# Altium schematic sheet car.SchDoc
size A2
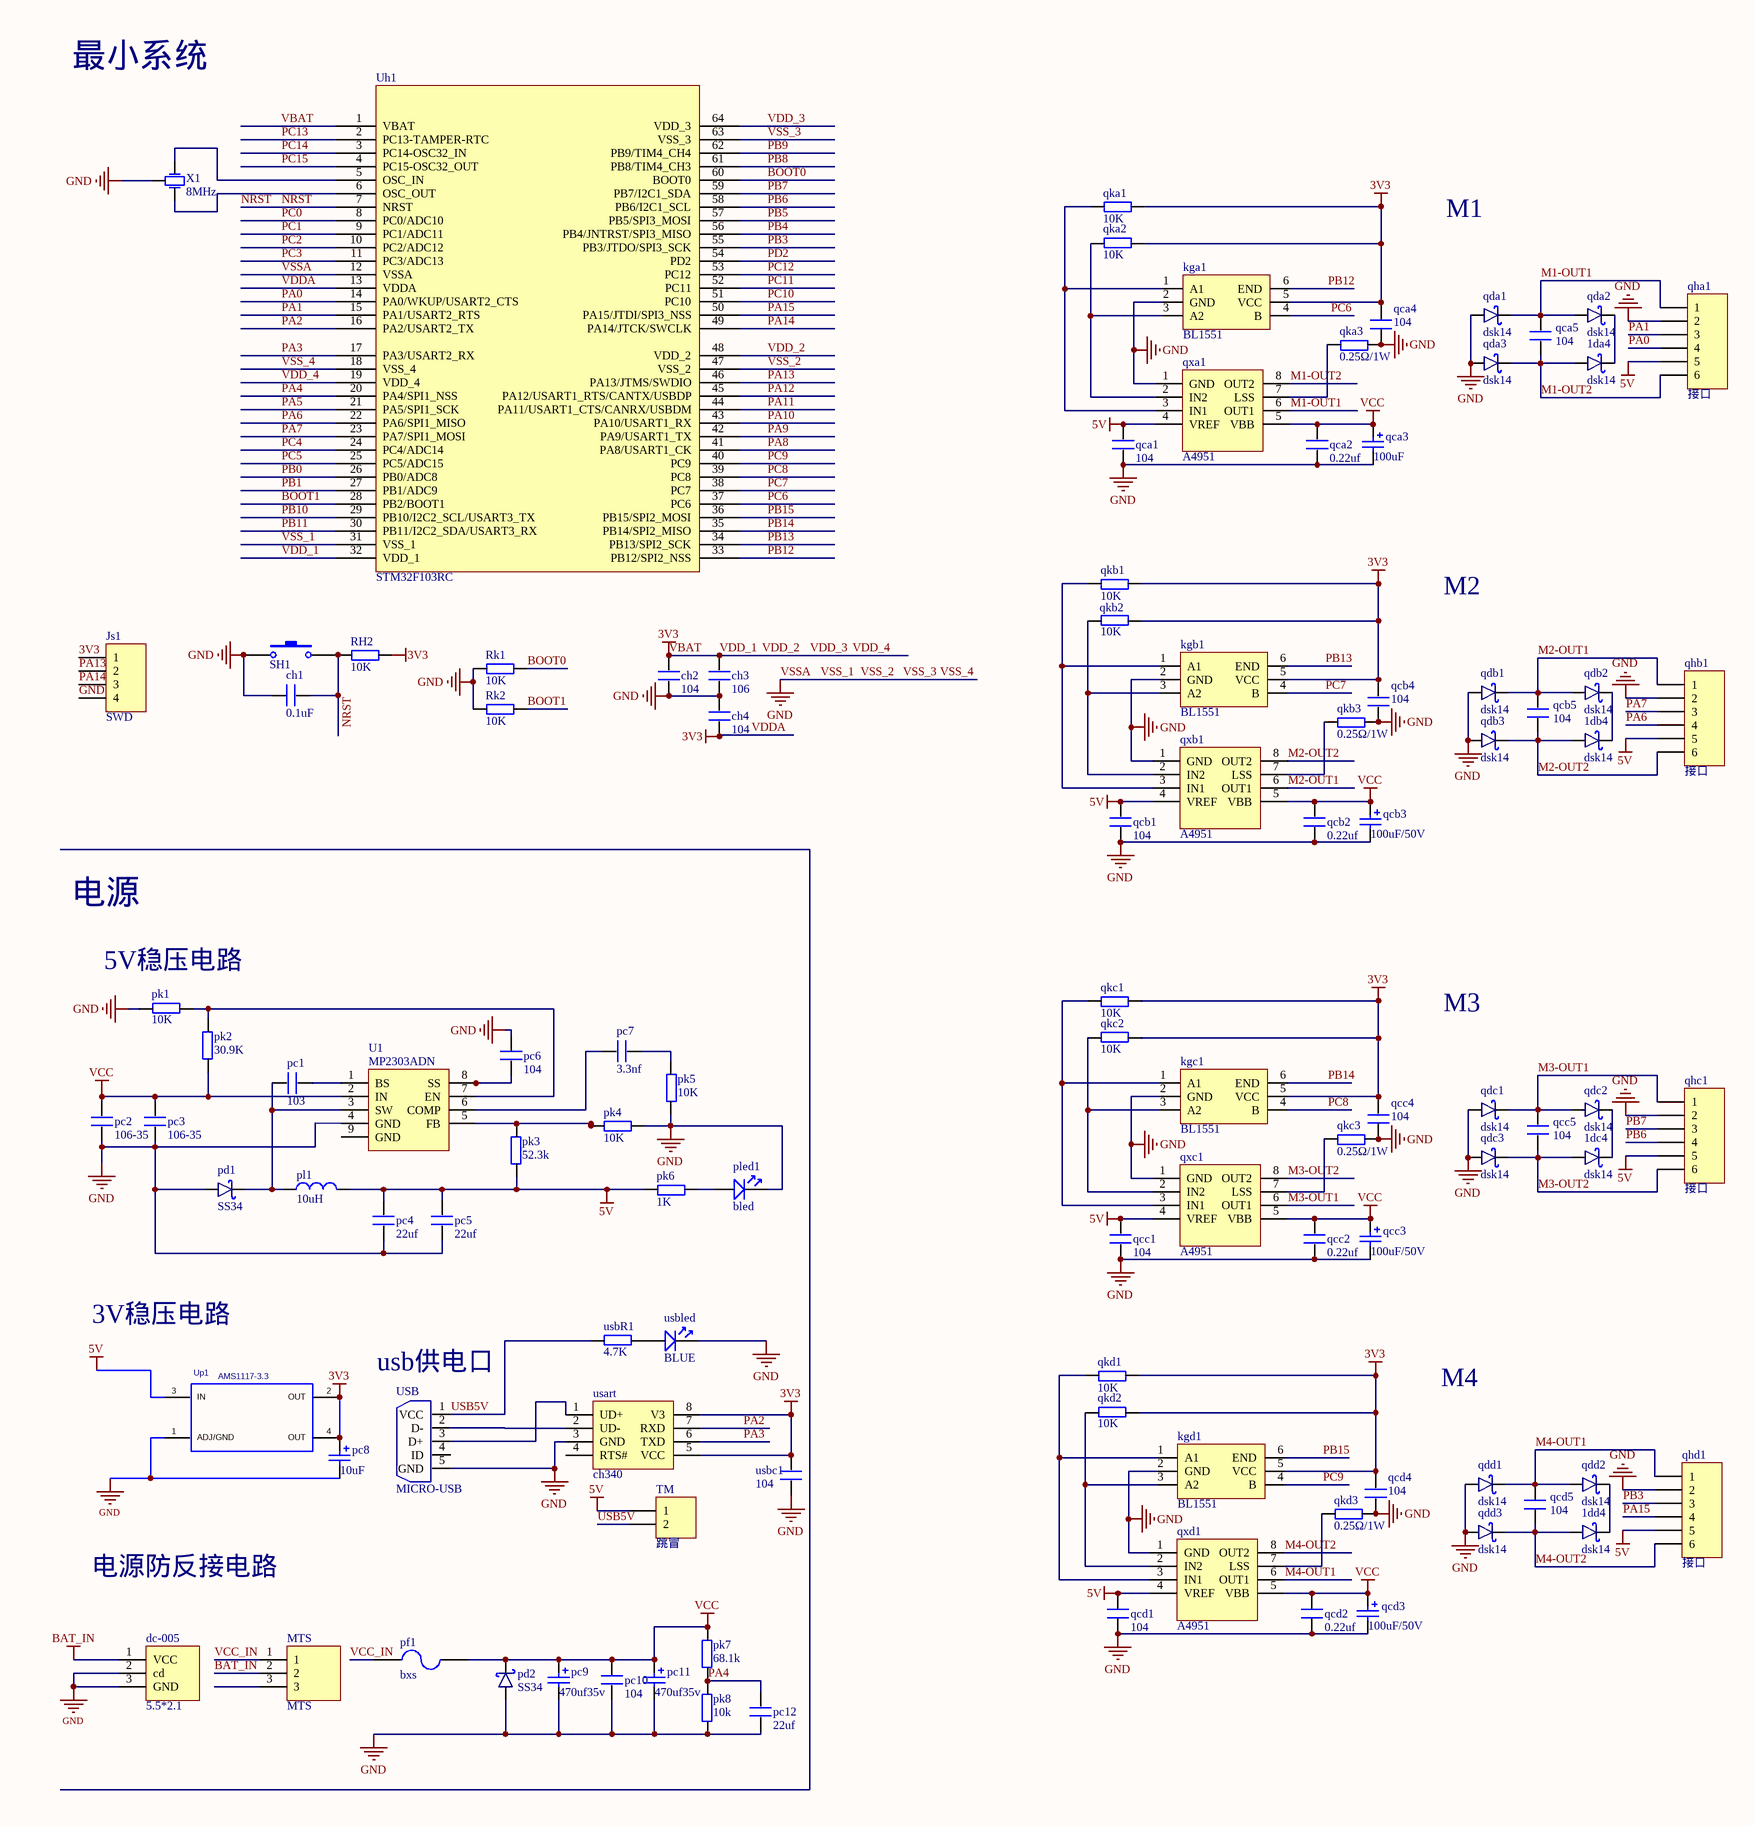
[diagram p0: car.SchDoc, left]
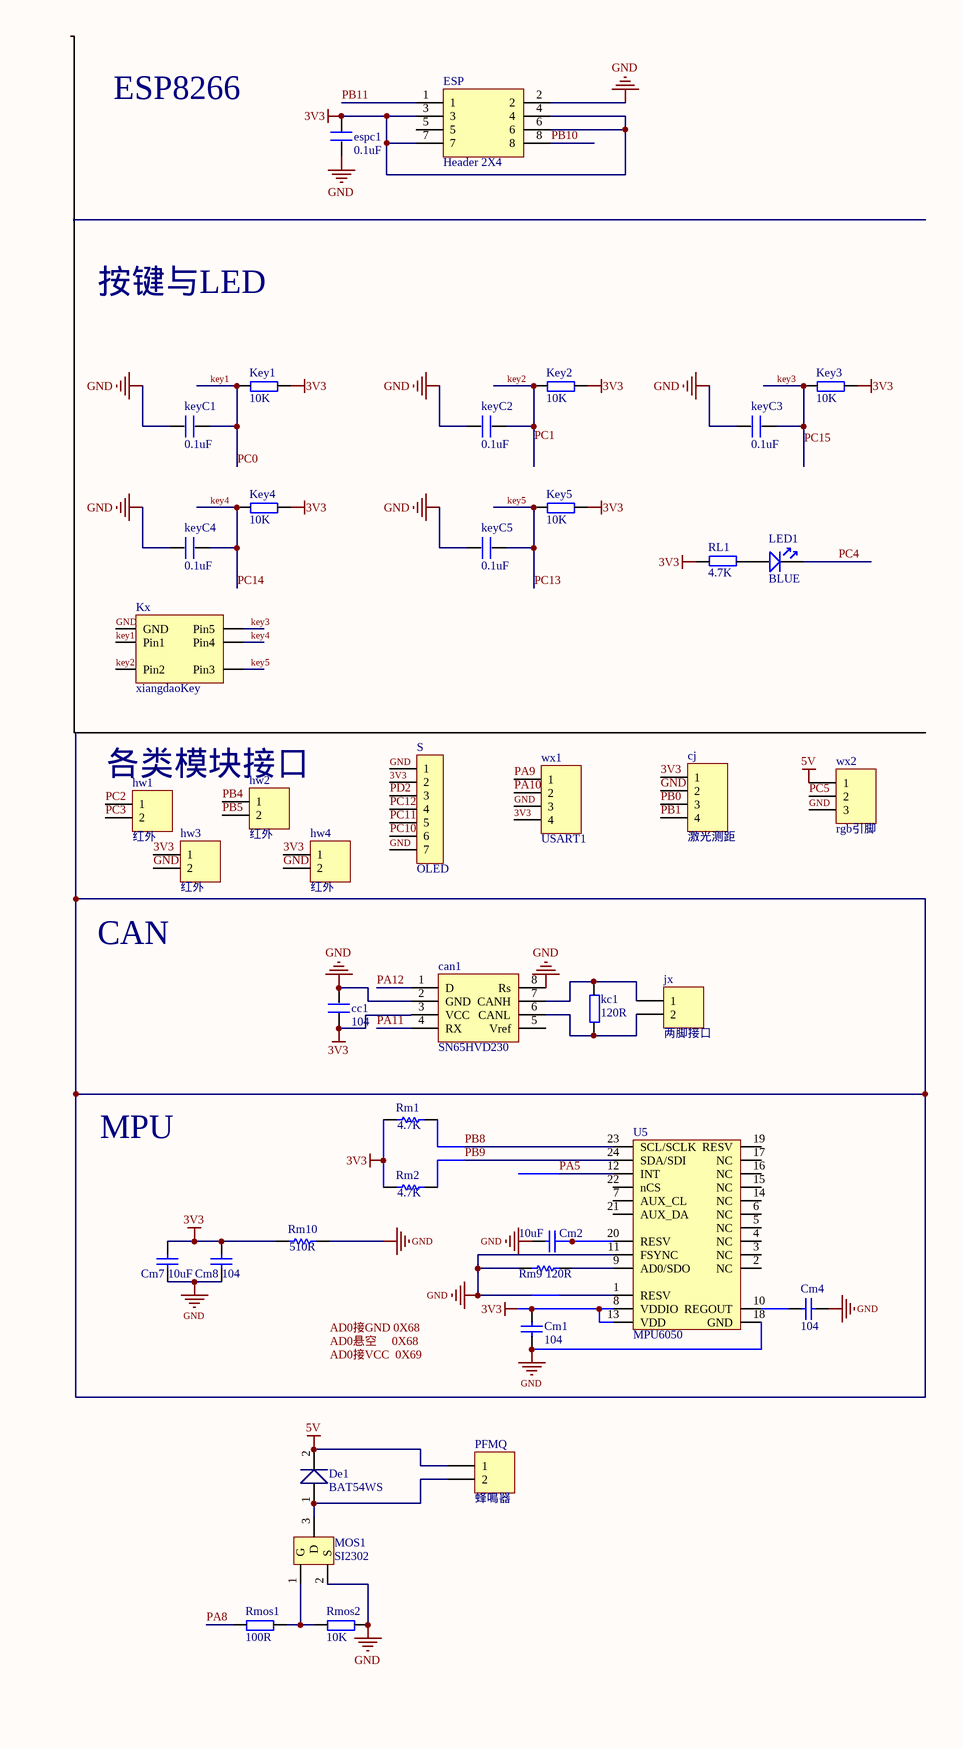
[diagram p1: car.SchDoc, right]

## Parts
1da4  dsk14  [SOD-123]
1db4  dsk14  [SOD-123]
1dc4  dsk14  [SOD-123]
1dd4  dsk14  [SOD-123]
can1  SN65HVD230  [SOIC-8]
cc1  104  [C0603]
ch1  0.1uF  [C0603]
ch2  104  [C0603]
ch3  106  [C0603]
ch4  104  [C0603]
cj  激光测距  [HDR1X4]
Cm1  value 104  [C0603]  (hidden comment: Cap)
Cm2  value 10uF  [C0603]  (hidden comment: Cap)
Cm4  value 104  [C0603]  (hidden comment: Cap)
Cm7  value 10uF  [C0603]  (hidden comment: Cap)
Cm8  value 104  [C0603]  (hidden comment: Cap)
dc-005  5.5*2.1  [DC-005]
De1  BAT54WS  [SOD-323]
ESP  Header 2X4  [HDE2X4_2.54]
espc1  0.1uF  [C0603]
hw1  红外  [HDR1X2_2.54]
hw2  红外  [HDR1X2_2.54]
hw3  红外  [HDR1X2_2.54]
hw4  红外  [HDR1X2_2.54]
Js1  SWD  [1X4_1_25]
jx  两脚接口  [HDR1X2_2.54]
kc1  120R  [R0603]
Key1  10K  [R0603]
Key2  10K  [R0603]
Key3  10K  [R0603]
Key4  10K  [R0603]
Key5  10K  [R0603]
keyC1  0.1uF  [C0603]
keyC2  0.1uF  [C0603]
keyC3  0.1uF  [C0603]
keyC4  0.1uF  [C0603]
keyC5  0.1uF  [C0603]
kga1  BL1551  [SOT-363]
kgb1  BL1551  [SOT-363]
kgc1  BL1551  [SOT-363]
kgd1  BL1551  [SOT-363]
Kx  xiangdaoKey  [daohangKey]
LED1  BLUE  [L0603]
MOS1  SI2302  [SO-G3/C2.5]
MTS  MTS  [MTS-102]
pc1  103  [C0603]
pc2  106-35  [1206]
pc3  106-35  [1206]
pc4  22uf  [C0603]
pc5  22uf  [C0603]
pc6  104  [C0603]
pc7  3.3nf  [C0603]
pc8  value 10uF  [C1206钽]  (hidden comment: Cap Pol2)
pc9  value 470uf35v  [CED10]  (hidden comment: Cap Pol2)
pc10  104  [C0603]
pc11  value 470uf35v  [CED10]  (hidden comment: Cap Pol2)
pc12  22uf  [C0603]
pd1  SS34  [SMA(DO-214AC)]
pd2  SS34  [SMA(DO-214AC)]
pf1  bxs  [2410]
PFMQ  蜂鳴器  [FMQ_tp]
pk1  10K  [R0603]
pk2  30.9K  [R0603]
pk3  52.3k  [R0603]
pk4  10K  [R0603]
pk5  10K  [R0603]
pk6  1K  [R0603]
pk7  68.1k  [R0603]
pk8  10k  [R0603]
pl1  10uH  [6028]
pled1  bled  [LED0603]
qca1  104  [C0603]
qca2  0.22uf  [C0603]
qca3  value 100uF  [CED8]  (hidden comment: Cap Pol2)
qca4  104  [C0603]
qca5  104  [C0603]
qcb1  104  [C0603]
qcb2  0.22uf  [C0603]
qcb3  value 100uF/50V  [CED8]  (hidden comment: Cap Pol2)
qcb4  104  [C0603]
qcb5  104  [C0603]
qcc1  104  [C0603]
qcc2  0.22uf  [C0603]
qcc3  value 100uF/50V  [CED8]  (hidden comment: Cap Pol2)
qcc4  104  [C0603]
qcc5  104  [C0603]
qcd1  104  [C0603]
qcd2  0.22uf  [C0603]
qcd3  value 100uF/50V  [CED8]  (hidden comment: Cap Pol2)
qcd4  104  [C0603]
qcd5  104  [C0603]
qda1  dsk14  [SOD-123]
qda2  dsk14  [SOD-123]
qda3  dsk14  [SOD-123]
qdb1  dsk14  [SOD-123]
qdb2  dsk14  [SOD-123]
qdb3  dsk14  [SOD-123]
qdc1  dsk14  [SOD-123]
qdc2  dsk14  [SOD-123]
qdc3  dsk14  [SOD-123]
qdd1  dsk14  [SOD-123]
qdd2  dsk14  [SOD-123]
qdd3  dsk14  [SOD-123]
qha1  接口  [HDR1X6_2.0]
qhb1  接口  [HDR1X6_2.0]
qhc1  接口  [HDR1X6_2.0]
qhd1  接口  [HDR1X6_2.0]
qka1  10K  [R0603]
qka2  10K  [R0603]
qka3  0.25Ω/1W  [2512]
qkb1  10K  [R0603]
qkb2  10K  [R0603]
qkb3  0.25Ω/1W  [2512]
qkc1  10K  [R0603]
qkc2  10K  [R0603]
qkc3  0.25Ω/1W  [2512]
qkd1  10K  [R0603]
qkd2  10K  [R0603]
qkd3  0.25Ω/1W  [2512]
qxa1  A4951  [SOIC-8]
qxb1  A4951  [SOIC-8]
qxc1  A4951  [SOIC-8]
qxd1  A4951  [SOIC-8]
RH2  10K  [R0603]
Rk1  10K  [R0603]
Rk2  10K  [R0603]
RL1  4.7K  [0603P]
Rm1  value 4.7K  [R0603]  (hidden comment: Res1)
Rm2  value 4.7K  [R0603]  (hidden comment: Res1)
Rm9  value 120R  [R0603]  (hidden comment: Res1)
Rm10  value 510R  [R0603]  (hidden comment: Res1)
Rmos1  100R  [0603P]
Rmos2  10K  [0603P]
S  OLED  [HDR1X7_2.54]
SH1  SW_PB  [KEY1]  (value not drawn)
TM  跳冒  [HDR1X2_2.54]
U1  MP2303ADN  [MP2303A]
U5  MPU6050  [QFN24]
Uh1  STM32F103RC  [LQFP64]
Up1  AMS1117-3.3  [LC-SOT-223]
usart  ch340  [SOIC-8]
USB  MICRO-USB  [MICRO_USB5P_SOP]
usbc1  104  [C0603]
usbled  BLUE  [L0603]
usbR1  4.7K  [R0603]
wx1  USART1  [HDR1X4]
wx2  rgb引脚  [HDR1X3_2.54]
X1  8MHz  [XTAL3215]

## Nets
3V3: can1.3(VCC) cc1.2 ch2.1 ch3.1 ch4.2 cj.1 Cm1.2 Cm7.2 Cm8.2 ESP.3 ESP.4 ESP.6 ESP.7 espc1.1 hw3.1 hw4.1 Js1.1 Key1.2 Key2.2 Key3.2 Key4.2 Key5.2 kga1.5(VCC) kgb1.5(VCC) kgc1.5(VCC) kgd1.5(VCC) pc8.1 qca4.2 qcb4.2 qcc4.2 qcd4.2 qka1.2 qka2.1 qkb1.2 qkb2.1 qkc1.2 qkc2.1 qkd1.2 qkd2.1 RH2.2 RL1.2 Rm1.2 Rm2.2 Rm10.2 S.2 U5.8(VDDIO) U5.13(VDD) Uh1.1(VBAT) Uh1.13(VDDA) Uh1.19(VDD_4) Uh1.32(VDD_1) Uh1.48(VDD_2) Uh1.64(VDD_3) Up1.2(OUT) Up1.4(OUT) usart.5(VCC) usart.8(V3) usbc1.2 wx1.4  [also labelled VBAT, VDD_1, VDD_2, VDD_3, VDD_4, VDDA]
5V: De1.2 pc4.2 pc5.2 PFMQ.1 pk3.2 pk6.1 pl1.2 qca1.1 qcb1.1 qcc1.1 qcd1.1 qha1.5 qhb1.5 qhc1.5 qhd1.5 qxa1.4(VREF) qxb1.4(VREF) qxc1.4(VREF) qxd1.4(VREF) TM.1 Up1.3(IN) wx2.1
BAT_IN: dc-005.1(VCC) MTS.2
GND: can1.2(GND) can1.8(Rs) cc1.1 ch1.1 ch2.2 ch3.2 ch4.1 cj.2 Cm1.1 Cm2.1 Cm4.1 Cm7.1 Cm8.1 dc-005.2(cd) dc-005.3(GND) ESP.2 espc1.2 hw3.2 hw4.2 Js1.4 keyC1.1 keyC2.1 keyC3.1 keyC4.1 keyC5.1 kga1.2(GND) kgb1.2(GND) kgc1.2(GND) kgd1.2(GND) Kx.1(GND) MOS1.2(S) pc2.1 pc3.1 pc4.1 pc5.1 pc6.2 pc8.2 pc9.2 pc10.1 pc11.2 pc12.1 pd1.1 pd2.1 pk1.2 pk4.2 pk5.1 pk8.2 pled1.2 qca1.2 qca2.2 qca3.2 qca4.1 qcb1.2 qcb2.2 qcb3.2 qcb4.1 qcc1.2 qcc2.2 qcc3.2 qcc4.1 qcd1.2 qcd2.2 qcd3.2 qcd4.1 qda1.1 qda3.1 qdb1.1 qdb3.1 qdc1.1 qdc3.1 qdd1.1 qdd3.1 qha1.2 qhb1.2 qhc1.2 qhd1.2 qka3.2 qkb3.2 qkc3.2 qkd3.2 qxa1.1(GND) qxb1.1(GND) qxc1.1(GND) qxd1.1(GND) Rk1.1 Rk2.1 Rm9.2 Rm10.1 Rmos2.2 S.1 S.7 SH1.1 U1.4(GND) U5.1(RESV) U5.11(FSYNC) U5.18(GND) Uh1.12(VSSA) Uh1.18(VSS_4) Uh1.31(VSS_1) Uh1.47(VSS_2) Uh1.63(VSS_3) Up1.1(ADJ/GND) usart.3(GND) USB.5(GND) usbc1.1 usbled.2 wx1.3 wx2.3 X1.2(GND)  [also labelled VSS_1, VSS_2, VSS_3, VSS_4, VSSA]
VCC: pc2.2 pc3.2 pc9.1 pc10.2 pc11.1 pd2.2 pf1.2 pk2.2 pk7.1 qca2.1 qca3.1 qcb2.1 qcb3.1 qcc2.1 qcc3.1 qcd2.1 qcd3.1 qxa1.5(VBB) qxb1.5(VBB) qxc1.5(VBB) qxd1.5(VBB) U1.2(IN)
BOOT0: Rk1.2 Uh1.60(BOOT0)
BOOT1: Rk2.2 Uh1.28(PB2/BOOT1)
key1: Key1.1 keyC1.2 Kx.2(Pin1) Uh1.8(PC0/ADC10)  [also labelled PC0]
key2: Key2.1 keyC2.2 Kx.3(Pin2) Uh1.9(PC1/ADC11)  [also labelled PC1]
key3: Key3.1 keyC3.2 Kx.6(Pin5) Uh1.4(PC15-OSC32_OUT)  [also labelled PC15]
key4: Key4.1 keyC4.2 Kx.5(Pin4) Uh1.3(PC14-OSC32_IN)  [also labelled PC14]
key5: Key5.1 keyC5.2 Kx.4(Pin3) Uh1.2(PC13-TAMPER-RTC)  [also labelled PC13]
M1-OUT1: qca5.2 qda1.2 qda2.1 qha1.1 qxa1.6(OUT1)
M1-OUT2: 1da4.1 qca5.1 qda3.2 qha1.6 qxa1.8(OUT2)
M2-OUT1: qcb5.2 qdb1.2 qdb2.1 qhb1.1 qxb1.6(OUT1)
M2-OUT2: 1db4.1 qcb5.1 qdb3.2 qhb1.6 qxb1.8(OUT2)
M3-OUT1: qcc5.2 qdc1.2 qdc2.1 qhc1.1 qxc1.6(OUT1)
M3-OUT2: 1dc4.1 qcc5.1 qdc3.2 qhc1.6 qxc1.8(OUT2)
M4-OUT1: qcd5.2 qdd1.2 qdd2.1 qhd1.1 qxd1.6(OUT1)
M4-OUT2: 1dd4.1 qcd5.1 qdd3.2 qhd1.6 qxd1.8(OUT2)
NRST: ch1.2 RH2.1 SH1.2 Uh1.7(NRST)
PA0: qha1.4 Uh1.14(PA0/WKUP/USART2_CTS)
PA1: qha1.3 Uh1.15(PA1/USART2_RTS)
PA2: Uh1.16(PA2/USART2_TX) usart.7(RXD)
PA3: Uh1.17(PA3/USART2_RX) usart.6(TXD)
PA4: pc12.2 pk7.2 pk8.1 Uh1.20(PA4/SPI1_NSS)
PA5: U5.12(INT) Uh1.21(PA5/SPI1_SCK)
PA6: qhb1.4 Uh1.22(PA6/SPI1_MISO)
PA7: qhb1.3 Uh1.23(PA7/SPI1_MOSI)
PA8: Rmos1.1 Uh1.41(PA8/USART1_CK)
PA9: Uh1.42(PA9/USART1_TX) wx1.1
PA10: Uh1.43(PA10/USART1_RX) wx1.2
PA11: can1.4(RX) Uh1.44(PA11/USART1_CTS/CANRX/USBDM)
PA12: can1.1(D) Uh1.45(PA12/USART1_RTS/CANTX/USBDP)
PA13: Js1.2 Uh1.46(PA13/JTMS/SWDIO)
PA14: Js1.3 Uh1.49(PA14/JTCK/SWCLK)
PA15: qhd1.4 Uh1.50(PA15/JTDI/SPI3_NSS)
PB0: cj.3 Uh1.26(PB0/ADC8)
PB1: cj.4 Uh1.27(PB1/ADC9)
PB3: qhd1.3 Uh1.55(PB3/JTDO/SPI3_SCK)
PB4: hw2.1 Uh1.56(PB4/JNTRST/SPI3_MISO)
PB5: hw2.2 Uh1.57(PB5/SPI3_MOSI)
PB6: qhc1.4 Uh1.58(PB6/I2C1_SCL)
PB7: qhc1.3 Uh1.59(PB7/I2C1_SDA)
PB8: Rm1.1 U5.23(SCL/SCLK) Uh1.61(PB8/TIM4_CH3)
PB9: Rm2.1 U5.24(SDA/SDI) Uh1.62(PB9/TIM4_CH4)
PB10: ESP.8 Uh1.29(PB10/I2C2_SCL/USART3_TX)
PB11: ESP.1 Uh1.30(PB11/I2C2_SDA/USART3_RX)
PB12: kga1.6(END) Uh1.33(PB12/SPI2_NSS)
PB13: kgb1.6(END) Uh1.34(PB13/SPI2_SCK)
PB14: kgc1.6(END) Uh1.35(PB14/SPI2_MISO)
PB15: kgd1.6(END) Uh1.36(PB15/SPI2_MOSI)
PC2: hw1.1 Uh1.10(PC2/ADC12)
PC3: hw1.2 Uh1.11(PC3/ADC13)
PC4: LED1.2 Uh1.24(PC4/ADC14)
PC5: Uh1.25(PC5/ADC15) wx2.2
PC6: kga1.4(B) Uh1.37(PC6)
PC7: kgb1.4(B) Uh1.38(PC7)
PC8: kgc1.4(B) Uh1.39(PC8)
PC9: kgd1.4(B) Uh1.40(PC9)
PC10: S.6 Uh1.51(PC10)
PC11: S.5 Uh1.52(PC11)
PC12: S.4 Uh1.53(PC12)
PD2: S.3 Uh1.54(PD2)
USB5V: TM.2 USB.1(VCC) usbR1.2
VCC_IN: MTS.1 pf1.1
Net1da4_2: 1da4.2 qda2.2
Net1db4_2: 1db4.2 qdb2.2
Net1dc4_2: 1dc4.2 qdc2.2
Net1dd4_2: 1dd4.2 qdd2.2
Netcan1_6: can1.6(CANL) jx.2 kc1.1
Netcan1_7: can1.7(CANH) jx.1 kc1.2
NetCm2_2: Cm2.2 U5.20(RESV)
NetCm4_2: Cm4.2 U5.10(REGOUT)
NetDe1_1: De1.1 MOS1.3(D) PFMQ.2
Netkga1_1: kga1.1(A1) qka1.1 qxa1.3(IN1)
Netkga1_3: kga1.3(A2) qka2.2 qxa1.2(IN2)
Netkgb1_1: kgb1.1(A1) qkb1.1 qxb1.3(IN1)
Netkgb1_3: kgb1.3(A2) qkb2.2 qxb1.2(IN2)
Netkgc1_1: kgc1.1(A1) qkc1.1 qxc1.3(IN1)
Netkgc1_3: kgc1.3(A2) qkc2.2 qxc1.2(IN2)
Netkgd1_1: kgd1.1(A1) qkd1.1 qxd1.3(IN1)
Netkgd1_3: kgd1.3(A2) qkd2.2 qxd1.2(IN2)
NetLED1_1: LED1.1 RL1.1
NetMOS1_1: MOS1.1(G) Rmos1.2 Rmos2.1
Netpc1_1: pc1.1 pd1.2 pl1.1 U1.3(SW)
Netpc1_2: pc1.2 U1.1(BS)
Netpc6_1: pc6.1 U1.8(SS)
Netpc7_1: pc7.1 U1.6(COMP)
Netpc7_2: pc7.2 pk5.2
Netpk1_1: pk1.1 pk2.1 U1.7(EN)
Netpk3_1: pk3.1 pk4.1 U1.5(FB)
Netpk6_2: pk6.2 pled1.1
Netqka3_1: qka3.1 qxa1.7(LSS)
Netqkb3_1: qkb3.1 qxb1.7(LSS)
Netqkc3_1: qkc3.1 qxc1.7(LSS)
Netqkd3_1: qkd3.1 qxd1.7(LSS)
NetRm9_1: Rm9.1 U5.9(AD0/SDO)
NetUh1_5: Uh1.5(OSC_IN) X1.1(OSC1)
NetUh1_6: Uh1.6(OSC_OUT) X1.3(OSC2)
Netusart_1: usart.1(UD+) USB.3(D+)
Netusart_2: usart.2(UD-) USB.2(D-)
Netusbled_1: usbled.1 usbR1.1

Not connected (* = marked no-connect by the designer): can1 5(Vref); ESP 5; MTS 3; U1 9(GND); U5 2(NC) 3(NC) 4(NC) 5(NC) 6(NC) 7(AUX_CL) 14(NC) 15(NC) 16(NC) 17(NC) 19(RESV) 21(AUX_DA) 22(nCS); usart 4(RTS#); USB 4(ID)

## Notes on the sheet
- 最小系统
- ESP8266
- M1
- 按键与LED
- M2
- (near hw1) 各类模块接口
- 电源
- (near pk1) 5V稳压电路
- CAN
- M3
- MPU
- 3V稳压电路
- AD0接GND 0X68
- (near USB) usb供电口
- M4
- AD0悬空     0X68
- AD0接VCC  0X69
- 电源防反接电路

## Library data of the parts
1da4 1db4 1dc4 1dd4 pd1 pd2 qda1-qda3 qdb1-qdb3 qdc1-qdc3 qdd1-qdd3 = D Schottky: ST SS34
cc1 ch1-ch4 espc1 keyC1-keyC5 pc1-pc7 pc10 pc12 qca1 qca2 qca4 qca5 qcb1 qcb2 qcb4 qcb5 qcc1 qcc2 qcc4 qcc5 qcd1 qcd2 qcd4 qcd5 usbc1 = C
cj wx1 = Header 4: Header, 4-Pin; LatestRevisionDate: 17-Jul-2002; LatestRevisionNote: Re-released for DXP Platform.; Publisher: Altium Limited
Cm1 Cm2 Cm4 Cm7 Cm8 = Cap: Capacitor; Published: 8-Jun-2000; LatestRevisionDate: 17-Jul-2002; LatestRevisionNote: Re-released for DXP Platform.; PackageReference: RAD-0.3; Publisher: Altium Limited; PackageDescription: Radial Cap, Thru-Hole; 2 Leads; 0.3 in Pin Spacing
dc-005 = dc-005
De1 = BAT54: 单肖特基二极管
ESP = Header 2X4: HDE2X4
hw1-hw4 jx PFMQ TM = Header 2: Header, 2-Pin; LatestRevisionDate: 17-Jul-2002; LatestRevisionNote: Re-released for DXP Platform.; Publisher: Altium Limited
Js1 = Header, 1*4-Pin: LatestRevisionDate: 17-Jul-2002; LatestRevisionNote: Re-released for DXP Platform.; Publisher: Altium Limited
kc1 Key1-Key5 pk1-pk8 qka1-qka3 qkb1-qkb3 qkc1-qkc3 qkd1-qkd3 RH2 Rk1 Rk2 RL1 Rmos1 Rmos2 usbR1 = R
Kx = XD_Key
LED1 pled1 usbled = LED
MOS1 = MOS-N: AP2306
pc8 pc9 pc11 qca3 qcb3 qcc3 qcd3 = Cap Pol2: Polarized Capacitor (Axial); Published: 8-Jun-2000; LatestRevisionDate: 17-Jul-2002; LatestRevisionNote: Re-released for DXP Platform.; PackageReference: POLAR0.8; Publisher: Altium Limited; PackageDescription: Polarized Capacitor; 2 Leads
pf1 = Fuse 2: Fuse; Published: 8-Jun-2000; LatestRevisionDate: 17-Jul-2002; LatestRevisionNote: Re-released for DXP Platform.; PackageReference: PIN-W2/E2.8; Publisher: Altium Limited; PackageDescription: Thru-Hole; 2 Leads
pl1 = LS1
qha1 qhb1 qhc1 qhd1 = Header 6: Header, 6-Pin; LatestRevisionDate: 17-Jul-2002; LatestRevisionNote: Re-released for DXP Platform.; Publisher: Altium Limited
Rm1 Rm2 Rm9 Rm10 = Res1: Resistor; Published: 8-Jun-2000; LatestRevisionDate: 17-Jul-2002; LatestRevisionNote: Re-released for DXP Platform.; PackageReference: AXIAL-0.3; Publisher: Altium Limited; PackageDescription: Axial Device, Thru-Hole; 2 Leads; 0.3 in Pin Spacing
S = Header 1X7_2_54: 7pin2_54mm
SH1 = KEY_DT: Published: 24-Mar-1999; LatestRevisionDate: 17-Jul-2002; LatestRevisionNote: Re-released for DXP Platform.; PackageReference: SPST-2; Publisher: Altium Limited; PackageDescription: Switch; 2 Leads
U1 = MP2303A: MPS MP2303ADN-LF-Z
U5 = MPU9250: 9轴运动处理传感器
Up1 = 1117-3.3: SOT-223; Manufacturer #1: SPX; Geometry.Height: 62.99mil; Manufacturer #1 PN: 1117-3.3
USB = USB5
wx2 = Header 3_1: LatestRevisionDate: 17-Jul-2002; LatestRevisionNote: Re-released for DXP Platform.; Publisher: Altium Limited
X1 = XTAL-3215